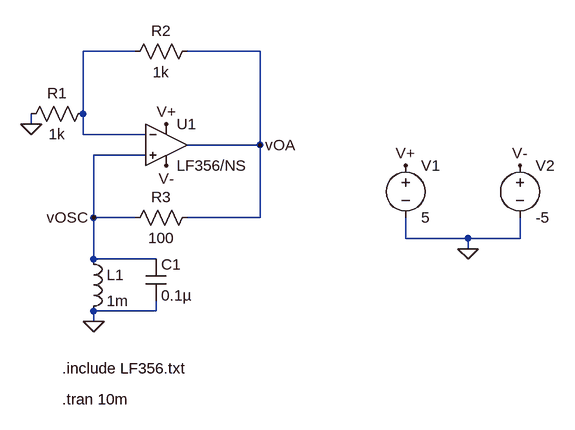
[diagram p0: schematic task3_sim.asc]
task3_sim.asc, the LTspice schematic file:
Version 4
SHEET 1 1076 680
WIRE 224 16 144 16
WIRE 416 16 304 16
WIRE 144 112 144 16
WIRE 64 128 64 112
WIRE 144 144 144 112
WIRE 240 144 144 144
WIRE 416 160 416 16
WIRE 416 160 304 160
WIRE 240 176 160 176
WIRE 160 272 160 176
WIRE 224 272 160 272
WIRE 416 272 416 160
WIRE 416 272 304 272
WIRE 640 304 640 272
WIRE 736 304 640 304
WIRE 816 304 816 272
WIRE 816 304 736 304
WIRE 736 320 736 304
WIRE 160 336 160 272
WIRE 256 336 160 336
WIRE 256 416 256 400
WIRE 256 416 160 416
WIRE 160 432 160 416
FLAG 64 128 0
FLAG 160 432 0
FLAG 272 128 V+
FLAG 272 192 V-
FLAG 160 272 vOSC
FLAG 416 160 vOA
FLAG 736 320 0
FLAG 640 192 V+
FLAG 816 192 V-
SYMBOL res 160 96 R90
WINDOW 0 0 56 VBottom 2
WINDOW 3 32 56 VTop 2
SYMATTR InstName R1
SYMATTR Value 1k
SYMBOL res 320 0 R90
WINDOW 0 0 56 VBottom 2
WINDOW 3 32 56 VTop 2
SYMATTR InstName R2
SYMATTR Value 1k
SYMBOL res 320 256 R90
WINDOW 0 0 56 VBottom 2
WINDOW 3 32 56 VTop 2
SYMATTR InstName R3
SYMATTR Value 100
SYMBOL ind 144 320 R0
SYMATTR InstName L1
SYMATTR Value 1m
SYMATTR SpiceLine Rser=2.1
SYMBOL cap 240 336 R0
SYMATTR InstName C1
SYMATTR Value 0.1µ
SYMBOL OpAmps\\opamp2 272 96 R0
SYMATTR InstName U1
SYMATTR Value LF356/NS
SYMBOL voltage 640 176 R0
WINDOW 123 0 0 Left 0
WINDOW 39 0 0 Left 0
SYMATTR InstName V1
SYMATTR Value 5
SYMBOL voltage 816 176 R0
WINDOW 123 0 0 Left 0
WINDOW 39 0 0 Left 0
SYMATTR InstName V2
SYMATTR Value -5
TEXT 112 504 Left 2 !.include LF356.txt
TEXT 112 552 Left 2 !.tran 10m

The netlist it stands for:
* task3_sim.asc
R1 N001 0 1k
R2 vOA N001 1k
R3 vOA vOSC 100
L1 vOSC 0 1m Rser=2.1
C1 vOSC 0 0.1µ
XU1 vOSC N001 V+ V- vOA LF356/NS  ; pins In+ In- V+ V- OUT
V1 V+ 0 5
V2 V- 0 -5
.include LF356.txt
.tran 10m
.backanno
.end